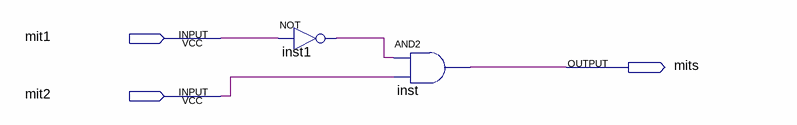
[diagram p0: schematic sheet]
// Quartus schematic Seletor.bdf as structural Verilog: 2 symbols, 3 pins
module Seletor (
  input  mit1,
  input  mit2,
  output mits
);

  wire inst1_out;

  not inst1 (inst1_out, mit1);
  and inst (mits, inst1_out, mit2);
endmodule
